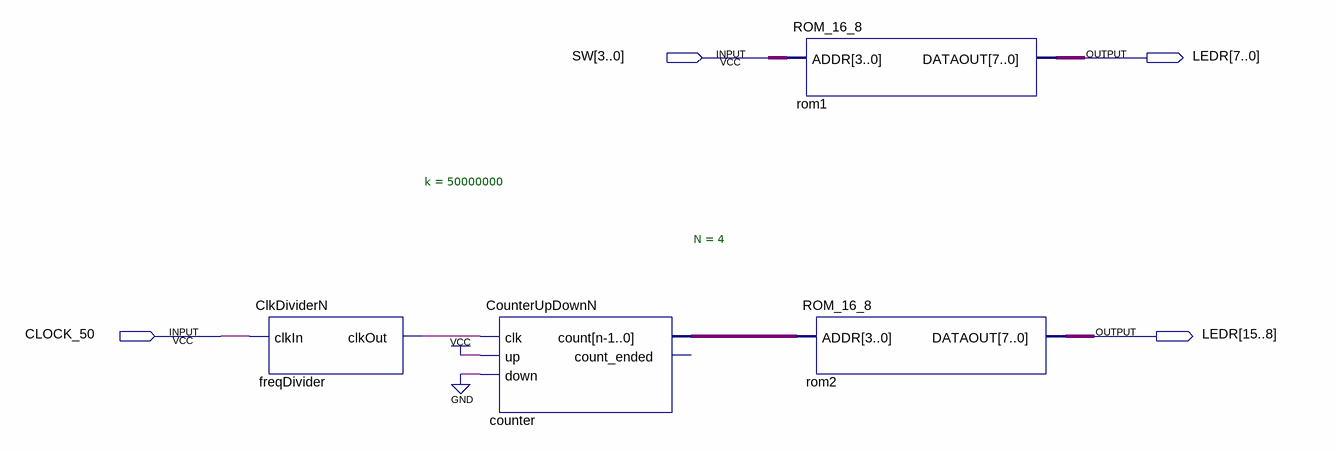
[diagram p0: schematic sheet]
// Quartus schematic ROM_Demo.bdf as structural Verilog: 4 symbols, 4 pins
module ROM_Demo (
  input  [3:0] SW,
  input  CLOCK_50,
  output [15:0] LEDR
);

  wire freqDivider_clkout;
  wire [3:0] counter_count;

  ClkDividerN #(.k(50000000)) freqDivider (.clkIn(CLOCK_50), .clkOut(freqDivider_clkout));
  CounterUpDownN #(.N(4)) counter (
    .clk(freqDivider_clkout), .up(1'b1), .down(1'b0), .count(counter_count));  // open: count_ended
  ROM_16_8 rom1 (.ADDR(SW), .DATAOUT(LEDR[7:0]));
  ROM_16_8 rom2 (.ADDR(counter_count), .DATAOUT(LEDR[15:8]));
endmodule
